# EAGLE design OpAmp_NonInvertente_V2 (EAGLE 7.2.0)
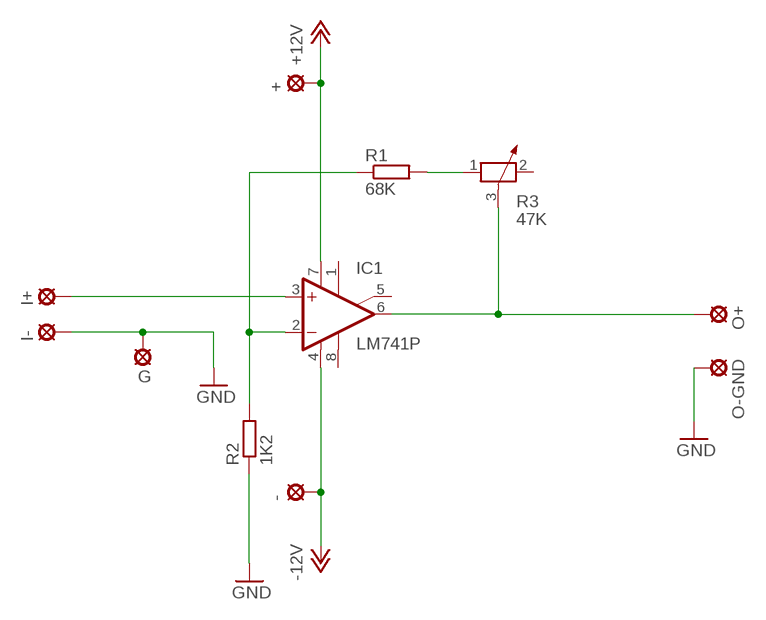
[diagram p0: schematic, sheet 1]

## Parts
+  LSP10  [LSP10]
-  LSP10  [LSP10]
G  LSP10  [LSP10]
I+  LSP10  [LSP10]
I-  LSP10  [LSP10]
IC1  LM741P  [DIL08]
O+  LSP10  [LSP10]
O-GND  LSP10  [LSP10]
R1  68K  R-EU_0207/12  [0207/12]
R2  1K2  R-EU_0207/12  [0207/12]
R3  47K  POTENTIOMETER_PT-10  [PT-10]

## Nets
+12V: +.MP IC1.7(V+)
-12V: -.MP IC1.4(V-)
N$1: IC1.2(-IN) R1.1 R2.2
N$2: R1.2 R3.1
N$3: IC1.6(OUT) O+.MP R3.3
N$4: I+.MP IC1.3(+IN)
N$5: G.MP I-.MP O-GND.MP R2.1 ; supply symbol labelled GND
Unconnected: IC1.1(ON1) IC1.5(ON2) IC1.8(OPT) R3.2

## Library data of the parts
+ - G I+ I- O+ O-GND = solpad:LSP10: SOLDER PAD drill 1.0 mm, distributor Buerklin, 12H555
IC1 = linear:*741: OP AMP
R1 R2 = resistor:R-EU_: RESISTOR, European symbol
R3 = rcl:POTENTIOMETER_: Potentiometer

## Board
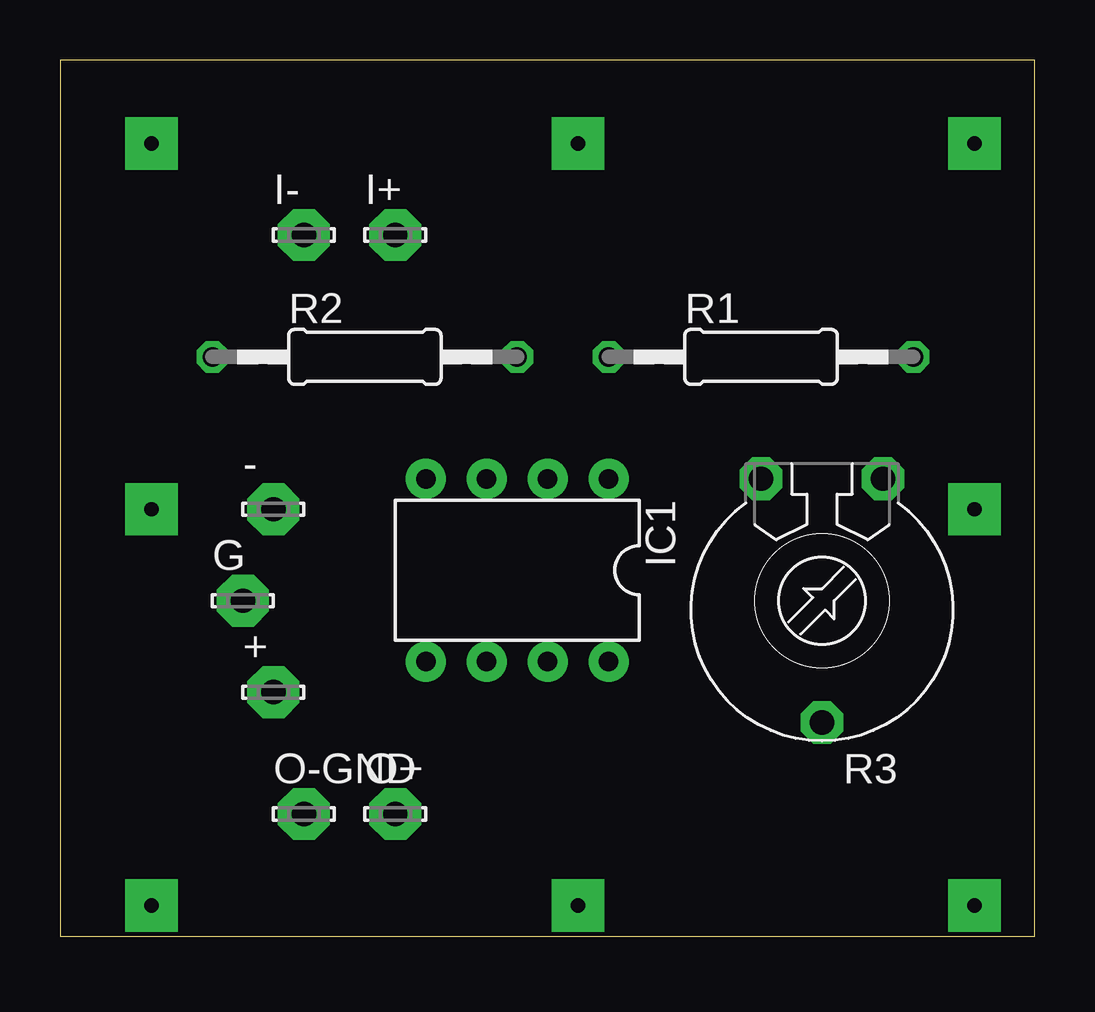
[diagram p1: board, top side]
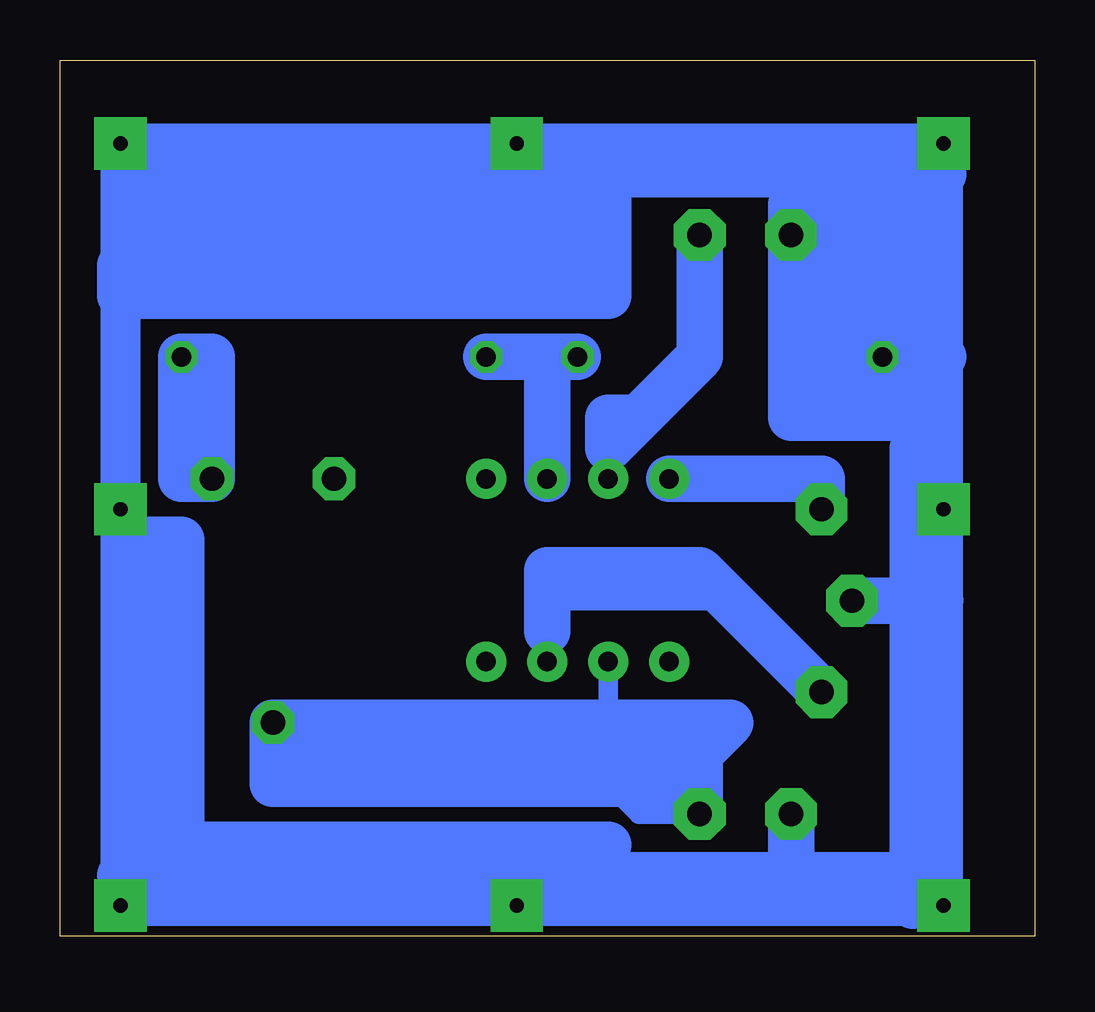
[diagram p2: board, bottom side, seen from below]

Size 40.62 x 36.5 mm. Coordinates in mm from the lower left corner, seen from the top.
Outline: 0,0 40.62,0 40.62,36.5 0,36.5 0,0
Copper layers (1*16): Top 0.035mm / dielectric 1.5mm / Bottom 0.035mm
Design rules "default": minimum track width 10mil, minimum drill 24mil, track to track 8mil, track to pad 8mil, pad to pad 8mil, via to via 8mil, smd to smd 8mil, copper to edge 40mil, drill to drill 8mil, minimum pad ring 10mil, minimum via ring 8mil, stop-mask expansion 4mil, vias tented up to drill 0mil, thermal gap 10mil

### Footprints (pad centres in the part's own frame; a part is rotated, then mirrored left to right if it is on the bottom)
LSP10 = drill 1.016 pad 2.159 octagon: MP 0,0
DIL08 = drill 0.813 pad 1.676: 1 -3.81,-3.81; 2 -1.27,-3.81; 3 1.27,-3.81; 4 3.81,-3.81; 5 3.81,3.81; 6 1.27,3.81; 7 -1.27,3.81; 8 -3.81,3.81
0207/12 = drill 0.813 octagon: 1 -6.35,0; 2 6.35,0
PT-10 = drill 1.016 pad 1.778 octagon: 1 -2.54,-5.08; 2 2.54,-5.08; 3 0,5.08

### Placement (x,y rotation side)
+  8.89,10.16 0 top
-  8.89,17.78 0 top
G  7.62,13.97 0 top
I+  13.97,29.21 0 top
I-  10.16,29.21 0 top
IC1  19.05,15.24 180 top
O+  13.97,5.08 0 top
O-GND  10.16,5.08 0 top
R1  29.21,24.13 0 top
R2  12.7,24.13 0 top
R3  31.75,13.97 180 top

### Tracks (layer width: path | path; a pad name or v marks a point on that pad's centre or on a via)
+12V
  Bottom 0.813: IC1.7 20.32,12.7 20.32,13.97 12.7,13.97
  Bottom 1.93: +.MP 12.7,13.97 13.97,15.24 20.32,15.24 20.32,12.7
-12V
  Bottom 1.93: IC1.4 8.89,19.05 -.MP
N$1
  Bottom 1.93: R2.2 20.32,24.13 | 20.32,24.13 R1.1 | IC1.2 20.32,24.13
N$2
  Bottom 0.813: 34.29,22.86 R1.2
  Bottom 1.93: R1.2 34.29,24.13 34.29,22.86 R3.1 35.56,19.05 R1.2
N$3
  Bottom 0.813: O+.MP 16.51,5.08 17.78,6.35 17.78,8.89 IC1.6 | 31.75,7.62 30.48,6.35
  Bottom 1.93: 15.24,6.35 17.78,6.35 20.32,6.35 | 20.32,6.35 30.48,6.35 31.75,6.35 31.75,7.62 | 15.24,6.35 17.78,8.89 | 17.78,8.89 19.05,7.62 | 20.32,6.35 19.05,7.62 | 19.05,7.62 31.75,7.62 | 31.75,7.62 R3.3 17.78,8.89 | 17.78,8.89 12.7,8.89 13.97,7.62 O+.MP 15.24,6.35 | 15.24,6.35 15.24,7.62
N$4
  Bottom 0.813: 17.78,20.32 IC1.3
  Bottom 1.93: I+.MP 13.97,24.13 16.51,21.59 | 16.51,21.59 17.78,21.59 17.78,20.32 16.51,21.59
N$5  (via drill 0.6 pad 2.18)
  Bottom 0.813: 10.16,30.48 10.16,33.02 v38.1,33.02 | 38.1,2.54 38.1,27.94 | 5.08,13.97 3.81,13.97 | R2.1 5.08,24.13 | 10.16,2.54 10.16,1.27
  Bottom 1.676: v3.81,33.02 10.16,33.02 v21.59,33.02 v38.1,33.02 38.1,27.94 v38.1,17.78 38.1,2.54 v38.1,1.27 v21.59,1.27 10.16,1.27 5.08,1.27 v3.81,1.27 3.81,13.97 v3.81,17.78 3.81,24.13 3.81,31.75 v3.81,33.02
  Bottom 1.93: 8.89,31.75 17.78,31.75 | 17.78,31.75 17.78,30.48 | 17.78,30.48 17.78,29.21 | 17.78,29.21 17.78,26.67 38.1,26.67 38.1,27.94 19.05,27.94 | 3.81,31.75 7.62,31.75 7.62,22.86 | 3.81,24.13 5.08,24.13 | 5.08,24.13 5.08,30.48 6.35,30.48 6.35,21.59 | 6.35,21.59 5.08,21.59 5.08,24.13 | 5.08,17.78 5.08,13.97 | 5.08,13.97 5.08,2.54 | 5.08,2.54 5.08,1.27 | 5.08,2.54 10.16,2.54 | 10.16,2.54 35.56,2.54 | 38.1,2.54 35.56,2.54 | 35.56,2.54 35.56,16.51 36.83,16.51 36.83,3.81 17.78,3.81 | O-GND.MP 10.16,2.54 | 10.16,30.48 I-.MP 10.16,21.59 6.35,21.59 | v3.81,17.78 5.08,17.78 | 5.08,17.78 5.08,20.32 | 17.78,29.21 36.83,29.21 | 17.78,30.48 36.83,30.48 | 17.78,31.75 36.83,31.75 | G.MP 5.08,13.97
N$6
  Bottom 1.93: 8.89,22.86 8.89,30.48